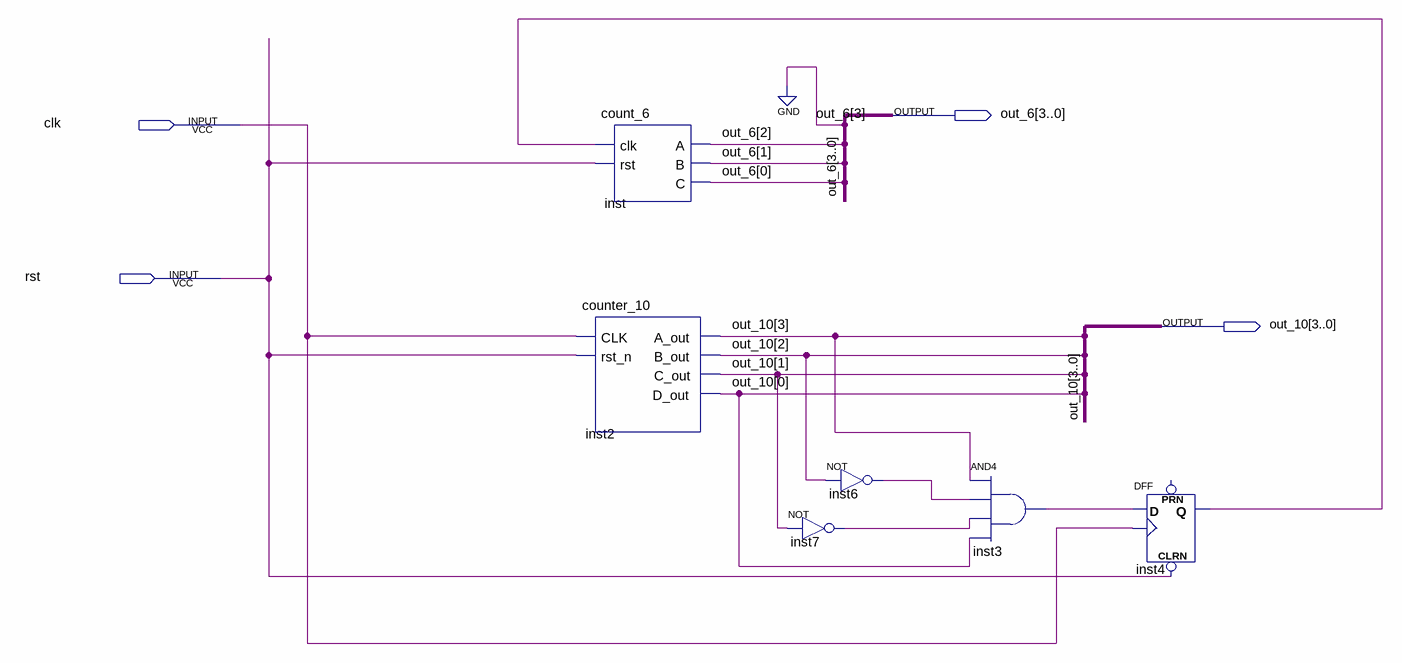
[diagram p0: schematic sheet]
// Quartus schematic count_60.bdf as structural Verilog: 6 symbols, 4 pins
module count_60 (
  input  clk,
  input  rst,
  output [3:0] out_6,
  output [3:0] out_10
);

  wire inst3_out, inst4_q, inst6_out, inst7_out;

  count_6 inst (.clk(inst4_q), .rst(rst), .A(out_6[2]), .B(out_6[1]), .C(out_6[0]));
  counter_10 inst2 (.CLK(clk), .rst_n(rst), .A_out(out_10[3]), .B_out(out_10[2]), .C_out(out_10[1]), .D_out(out_10[0]));
  not inst6 (inst6_out, out_10[2]);
  not inst7 (inst7_out, out_10[1]);
  and inst3 (inst3_out, out_10[3], inst6_out, inst7_out, out_10[0]);
  DFF inst4 (.CLRN(rst), .CLK(clk), .D(inst3_out), .Q(inst4_q));  // open: PRN

  assign out_6[3] = 1'b0;
endmodule
